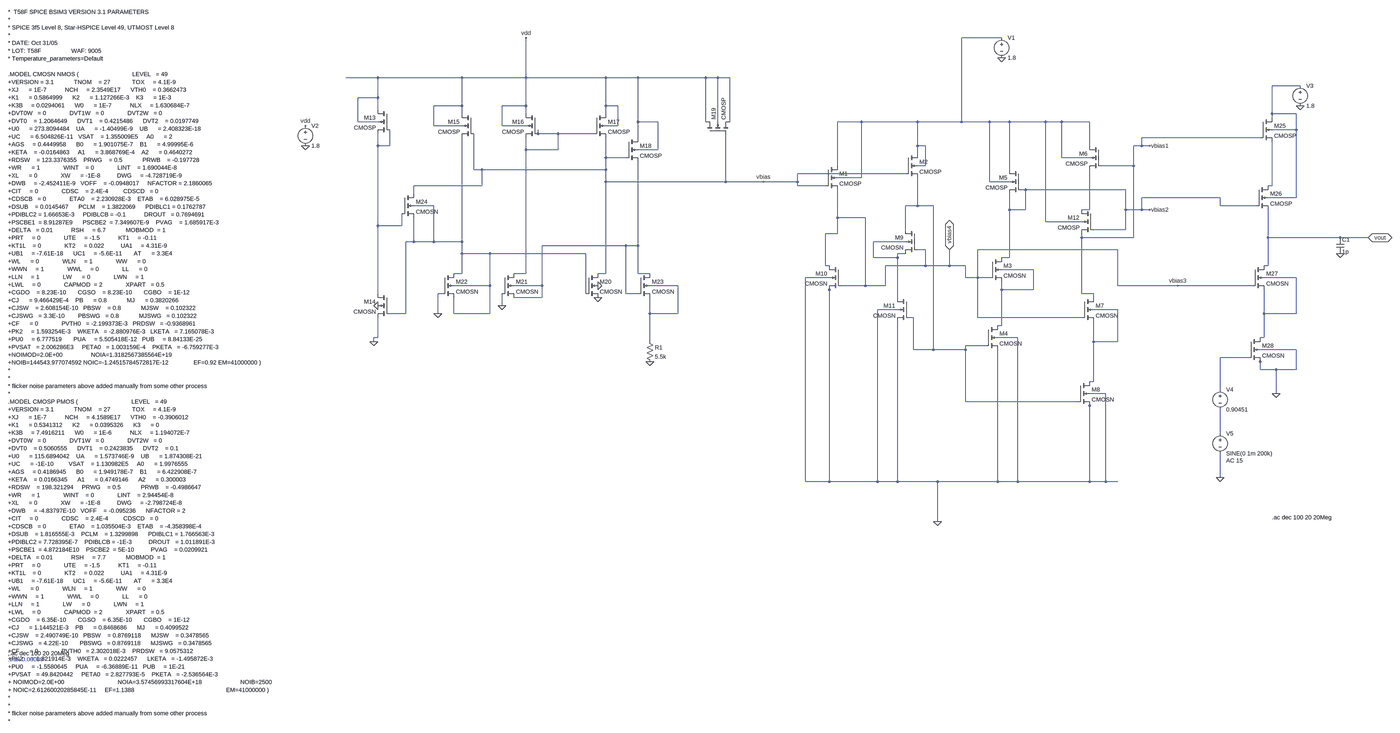
[diagram p0: schematic 180nm_circuit.asc, whole sheet]
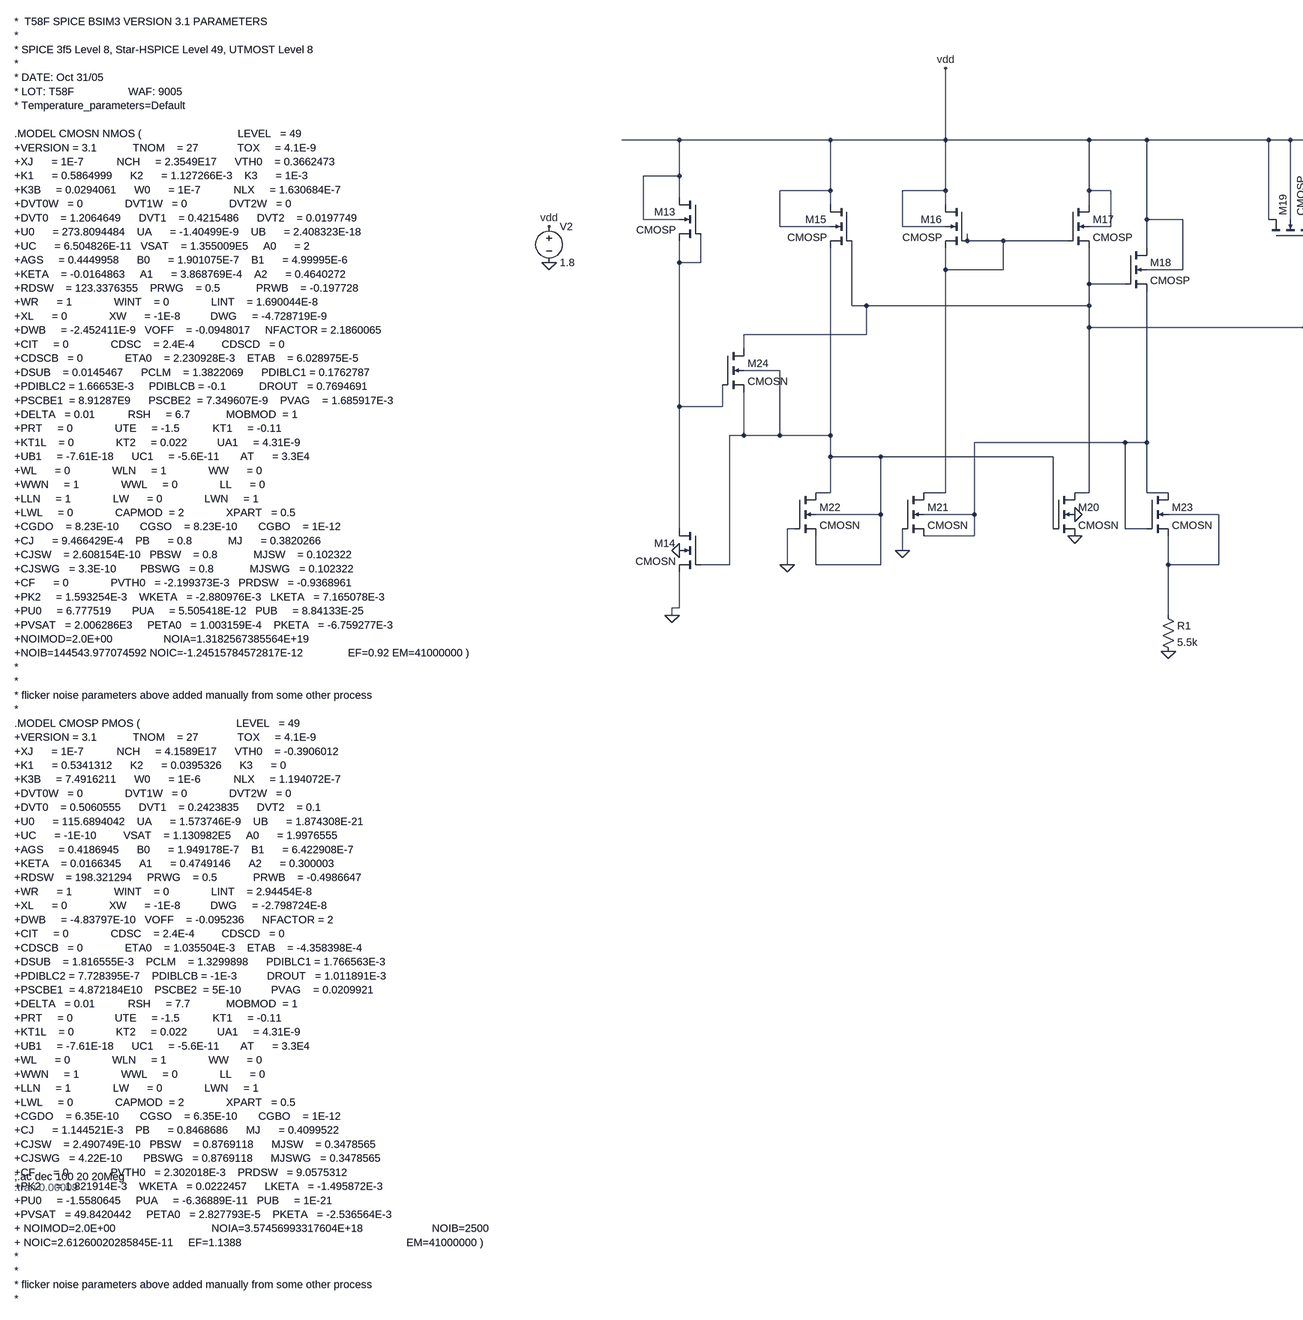
[diagram p1: schematic 180nm_circuit.asc, part, row 1 of 1, column 1 of 2]
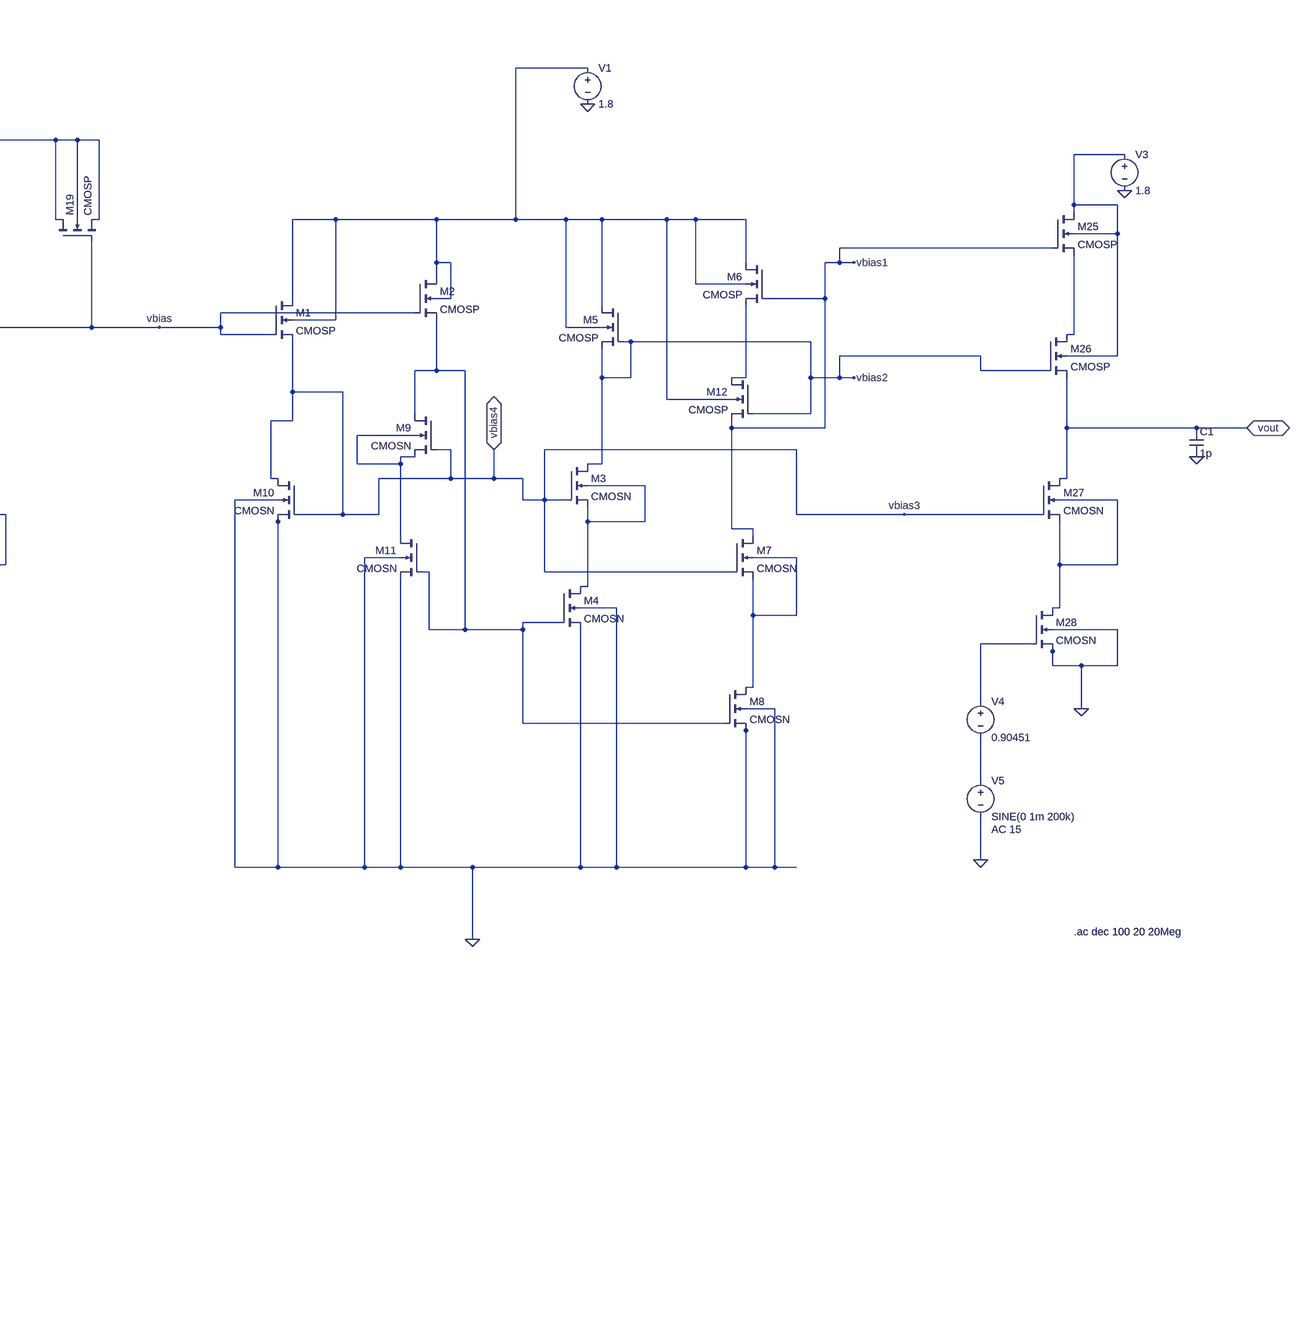
[diagram p2: schematic 180nm_circuit.asc, part, row 1 of 1, column 2 of 2]
180nm_circuit.asc, the LTspice schematic file:
Version 4
SHEET 1 3600 2120
WIRE 2016 -384 1856 -384
WIRE -960 -224 -1088 -224
WIRE -624 -224 -960 -224
WIRE -368 -224 -368 -384
WIRE -368 -224 -624 -224
WIRE -32 -224 -368 -224
WIRE 96 -224 -32 -224
WIRE 384 -224 96 -224
WIRE 432 -224 384 -224
WIRE 480 -224 432 -224
WIRE 3216 -192 3104 -192
WIRE -960 -144 -960 -224
WIRE -960 -144 -1040 -144
WIRE -624 -112 -624 -224
WIRE -624 -112 -736 -112
WIRE -368 -112 -368 -224
WIRE -368 -112 -464 -112
WIRE -32 -112 -32 -224
WIRE 16 -112 -32 -112
WIRE -960 -96 -960 -144
WIRE -624 -80 -624 -112
WIRE -368 -80 -368 -112
WIRE -32 -80 -32 -112
WIRE 3104 -80 3104 -192
WIRE 3200 -80 3104 -80
WIRE 3104 -64 3104 -80
WIRE -1040 -48 -1040 -144
WIRE -960 -48 -1040 -48
WIRE 96 -48 96 -224
WIRE 176 -48 96 -48
WIRE 384 -48 384 -224
WIRE 432 -48 432 -224
WIRE 480 -48 480 -224
WIRE 1456 -48 1360 -48
WIRE 1680 -48 1456 -48
WIRE 1856 -48 1856 -384
WIRE 1856 -48 1680 -48
WIRE 1968 -48 1856 -48
WIRE 2048 -48 1968 -48
WIRE 2192 -48 2048 -48
WIRE 2256 -48 2192 -48
WIRE 2368 -48 2256 -48
WIRE -736 -32 -736 -112
WIRE -624 -32 -736 -32
WIRE -464 -32 -464 -112
WIRE -368 -32 -464 -32
WIRE 16 -32 16 -112
WIRE 16 -32 -32 -32
WIRE 3200 -16 3200 -80
WIRE 3200 -16 3104 -16
WIRE -320 0 -320 -16
WIRE -240 0 -320 0
WIRE -80 0 -240 0
WIRE 96 16 96 -48
WIRE 3056 16 2576 16
WIRE -960 48 -960 0
WIRE -912 48 -912 -16
WIRE -912 48 -960 48
WIRE 1680 48 1680 -48
WIRE 1712 48 1680 48
WIRE 2368 48 2368 -48
WIRE 2576 48 2576 16
WIRE 2576 48 2544 48
WIRE 2608 48 2576 48
WIRE -368 64 -368 16
WIRE -240 64 -240 0
WIRE -240 64 -368 64
WIRE 176 64 176 -48
WIRE 176 64 96 64
WIRE 1680 80 1680 48
WIRE -32 96 -32 16
WIRE 48 96 -32 96
WIRE 2256 96 2256 -48
WIRE 2368 96 2256 96
WIRE 1360 128 1360 -48
WIRE 1712 128 1712 48
WIRE 1712 128 1680 128
WIRE 2544 128 2544 48
WIRE 2544 128 2416 128
WIRE -576 144 -576 0
WIRE -544 144 -576 144
WIRE -32 144 -32 96
WIRE -32 144 -544 144
WIRE 2048 144 2048 -48
WIRE 1632 160 1200 160
WIRE 1456 176 1456 -48
WIRE 1456 176 1360 176
WIRE -32 192 -32 144
WIRE 464 192 464 0
WIRE 464 192 -32 192
WIRE 816 192 464 192
WIRE 1200 192 1200 160
WIRE 1200 192 816 192
WIRE 1968 192 1968 -48
WIRE 2048 192 1968 192
WIRE -544 208 -544 144
WIRE -544 208 -816 208
WIRE 1200 208 1200 192
WIRE 1312 208 1200 208
WIRE 3104 208 3104 32
WIRE 3104 208 3088 208
WIRE 2112 224 2096 224
WIRE 2512 224 2112 224
WIRE -816 240 -816 208
WIRE 2896 256 2576 256
WIRE 3200 256 3200 -16
WIRE 3200 256 3088 256
WIRE -736 288 -816 288
WIRE 1680 288 1680 176
WIRE 1680 288 1632 288
WIRE 1744 288 1680 288
WIRE 2896 288 2896 256
WIRE 3040 288 2896 288
WIRE 2048 304 2048 240
WIRE 2112 304 2112 224
WIRE 2112 304 2048 304
WIRE 2368 304 2368 144
WIRE 2368 304 2336 304
WIRE 2512 304 2512 224
WIRE 2576 304 2576 256
WIRE 2576 304 2512 304
WIRE 2608 304 2576 304
WIRE 1360 336 1360 224
WIRE 1472 336 1360 336
WIRE 2192 352 2192 -48
WIRE 2336 352 2192 352
WIRE -960 368 -960 48
WIRE -864 368 -864 320
WIRE -864 368 -960 368
WIRE 1632 384 1632 288
WIRE 2512 384 2512 304
WIRE 2512 384 2384 384
WIRE 1360 400 1360 336
WIRE 1360 400 1312 400
WIRE 2336 416 2336 400
WIRE 2544 416 2544 128
WIRE 2544 416 2336 416
WIRE 3088 416 3088 304
WIRE 3376 416 3088 416
WIRE 3488 416 3376 416
WIRE -816 432 -816 336
WIRE -816 432 -848 432
WIRE -736 432 -736 288
WIRE -736 432 -816 432
WIRE -624 432 -624 16
WIRE -624 432 -736 432
WIRE 1632 432 1504 432
WIRE 48 448 -304 448
WIRE 96 448 96 112
WIRE 96 448 48 448
WIRE 1712 464 1680 464
WIRE 2480 464 1920 464
WIRE -624 480 -624 432
WIRE -512 480 -624 480
WIRE -112 480 -512 480
WIRE 1632 480 1600 480
WIRE 1504 496 1504 432
WIRE 1600 496 1600 480
WIRE 1600 496 1504 496
WIRE 2048 496 2048 304
WIRE 2048 496 2016 496
WIRE 1312 528 1312 400
WIRE 1328 528 1312 528
WIRE 1712 528 1712 464
WIRE 1712 528 1552 528
WIRE 1808 528 1808 464
WIRE 1808 528 1712 528
WIRE 1872 528 1808 528
WIRE 3088 528 3088 416
WIRE 3088 528 3072 528
WIRE 2144 544 2016 544
WIRE -624 560 -624 480
WIRE -624 560 -656 560
WIRE -368 560 -368 64
WIRE -368 560 -416 560
WIRE -32 560 -32 192
WIRE -32 560 -64 560
WIRE 96 560 96 448
WIRE 144 560 96 560
WIRE 1328 576 1232 576
WIRE 1872 576 1872 528
WIRE 1920 576 1920 464
WIRE 1920 576 1872 576
WIRE 1968 576 1920 576
WIRE 3200 576 3072 576
WIRE -512 608 -512 480
WIRE -512 608 -656 608
WIRE -304 608 -304 448
WIRE -304 608 -416 608
WIRE 256 608 144 608
WIRE 1472 608 1472 336
WIRE 1472 608 1376 608
WIRE 1552 608 1552 528
WIRE 1552 608 1472 608
WIRE 2480 608 2480 464
WIRE 2720 608 2480 608
WIRE 3024 608 2720 608
WIRE 1328 624 1328 608
WIRE 2016 624 2016 592
WIRE 2144 624 2144 544
WIRE 2144 624 2016 624
WIRE -960 640 -960 368
WIRE -704 640 -720 640
WIRE -112 640 -112 480
WIRE 48 640 48 448
WIRE 96 640 48 640
WIRE 2336 640 2336 416
WIRE 2384 640 2336 640
WIRE -304 656 -304 608
WIRE -304 656 -416 656
WIRE 1600 656 1600 496
WIRE 2384 656 2384 640
WIRE -464 688 -464 640
WIRE 1600 704 1520 704
WIRE 2480 704 2384 704
WIRE -848 720 -848 432
WIRE -848 720 -912 720
WIRE -720 720 -720 640
WIRE -656 720 -656 656
WIRE -512 720 -512 608
WIRE -512 720 -656 720
WIRE 144 720 144 656
WIRE 256 720 256 608
WIRE 256 720 144 720
WIRE 3072 720 3072 624
WIRE 3200 720 3200 576
WIRE 3200 720 3072 720
WIRE 1664 736 1648 736
WIRE 1920 736 1920 576
WIRE 2336 736 1920 736
WIRE 2016 768 2016 624
WIRE 2016 768 2000 768
WIRE -960 816 -960 736
WIRE -960 816 -976 816
WIRE 2080 816 2000 816
WIRE 3072 816 3072 720
WIRE 3072 816 3056 816
WIRE -976 832 -976 816
WIRE 144 832 144 720
WIRE 2384 832 2384 752
WIRE 2480 832 2480 704
WIRE 2480 832 2384 832
WIRE 1952 848 1872 848
WIRE 1664 864 1664 736
WIRE 1744 864 1744 288
WIRE 1744 864 1664 864
WIRE 1872 864 1872 848
WIRE 1872 864 1744 864
WIRE 3200 864 3056 864
WIRE 3008 896 2896 896
WIRE 3056 912 3056 896
WIRE 3056 944 3056 912
WIRE 3120 944 3056 944
WIRE 3200 944 3200 864
WIRE 3200 944 3120 944
WIRE 2384 992 2384 832
WIRE 2384 992 2368 992
WIRE 2896 1024 2896 896
WIRE 2432 1040 2368 1040
WIRE 3120 1040 3120 944
WIRE 1872 1072 1872 864
WIRE 2320 1072 1872 1072
WIRE 2368 1088 2368 1072
WIRE 2896 1200 2896 1104
WIRE 2896 1376 2896 1280
WIRE 1232 1392 1232 576
WIRE 1328 1392 1328 624
WIRE 1328 1392 1232 1392
WIRE 1520 1392 1520 704
WIRE 1520 1392 1328 1392
WIRE 1600 1392 1600 752
WIRE 1600 1392 1520 1392
WIRE 1760 1392 1600 1392
WIRE 2000 1392 2000 864
WIRE 2000 1392 1760 1392
WIRE 2080 1392 2080 816
WIRE 2080 1392 2000 1392
WIRE 2368 1392 2368 1088
WIRE 2368 1392 2080 1392
WIRE 2432 1392 2432 1040
WIRE 2432 1392 2368 1392
WIRE 2480 1392 2432 1392
WIRE 1760 1552 1760 1392
FLAG 1808 464 vbias4
IOPIN 1808 464 BiDir
FLAG 2608 304 vbias2
FLAG 2608 48 vbias1
FLAG 2016 -304 0
FLAG 1760 1552 0
FLAG 144 912 0
FLAG -64 656 0
FLAG -464 688 0
FLAG -720 720 0
FLAG -976 832 0
FLAG -64 608 0
FLAG -960 688 0
FLAG -1456 48 0
FLAG -1456 -32 vdd
FLAG -368 -384 vdd
FLAG 816 192 vbias
FLAG 3216 -112 0
FLAG 3120 1040 0
FLAG 2896 1376 0
FLAG 3376 480 0
FLAG 3488 416 vout
IOPIN 3488 416 BiDir
FLAG 2720 608 vbias3
DATAFLAG 2048 352 ""
DATAFLAG 2048 96 ""
SYMBOL nmos4 1312 128 R0
SYMATTR InstName M1
SYMATTR Value CMOSP
SYMATTR Value2 l=2u w=24u
SYMBOL nmos4 1632 80 R0
SYMATTR InstName M2
SYMATTR Value CMOSP
SYMATTR Value2 l=2u w=24u
SYMBOL nmos4 1968 496 R0
SYMATTR InstName M3
SYMATTR Value CMOSN
SYMATTR Value2 l=2u w=10u
SYMBOL nmos4 1952 768 R0
SYMATTR InstName M4
SYMATTR Value CMOSN
SYMATTR Value2 l=2u w=10u
SYMBOL nmos4 2096 144 M0
SYMATTR InstName M5
SYMATTR Value CMOSP
SYMATTR Value2 l=2u w=24u
SYMBOL nmos4 2416 48 M0
SYMATTR InstName M6
SYMATTR Value CMOSP
SYMATTR Value2 l=2u w=24u
SYMBOL nmos4 2336 656 R0
SYMATTR InstName M7
SYMATTR Value CMOSN
SYMATTR Value2 l=2u w=10u
SYMBOL nmos4 2320 992 R0
SYMATTR InstName M8
SYMATTR Value CMOSN
SYMATTR Value2 l=2u w=10u
SYMBOL nmos4 1680 384 M0
SYMATTR InstName M9
SYMATTR Value CMOSN
SYMATTR Value2 l=2u w=10u
SYMBOL nmos4 1376 528 M0
SYMATTR InstName M10
SYMATTR Value CMOSN
SYMATTR Value2 l=2u w=10u
SYMBOL nmos4 1648 656 M0
SYMATTR InstName M11
SYMATTR Value CMOSN
SYMATTR Value2 l=2u w=10u
SYMBOL nmos4 2384 304 M0
SYMATTR InstName M12
SYMATTR Value CMOSP
SYMATTR Value2 l=2u w=24u
SYMBOL voltage 2016 -400 R0
WINDOW 123 0 0 Left 0
WINDOW 39 0 0 Left 0
SYMATTR InstName V1
SYMATTR Value 1.8
SYMBOL nmos4 -912 -96 M0
SYMATTR InstName M13
SYMATTR Value CMOSP
SYMATTR Value2 l=2u w=24u
SYMBOL nmos4 -912 640 M0
SYMATTR InstName M14
SYMATTR Value CMOSN
SYMATTR Value2 l=2u w=10u
SYMBOL nmos4 -576 -80 M0
SYMATTR InstName M15
SYMATTR Value CMOSP
SYMATTR Value2 l=2u w=24u
SYMBOL nmos4 -320 -80 M0
SYMATTR InstName M16
SYMATTR Value CMOSP
SYMATTR Value2 l=2u w=24u
SYMBOL nmos4 -80 -80 R0
SYMATTR InstName M17
SYMATTR Value CMOSP
SYMATTR Value2 l=2u w=24u
SYMBOL nmos4 48 16 R0
SYMATTR InstName M18
SYMATTR Value CMOSP
SYMATTR Value2 l=2u w=24u
SYMBOL nmos4 384 0 R270
SYMATTR InstName M19
SYMATTR Value CMOSP
SYMATTR Value2 l=2u w=24u
SYMBOL nmos4 -112 560 R0
SYMATTR InstName M20
SYMATTR Value CMOSN
SYMATTR Value2 l=2u w=10u
SYMBOL nmos4 -464 560 R0
SYMATTR InstName M21
SYMATTR Value CMOSN
SYMATTR Value2 l=2u w=10u
SYMBOL nmos4 -704 560 R0
SYMATTR InstName M22
SYMATTR Value CMOSN
SYMATTR Value2 l=2u w=10u
SYMBOL nmos4 96 560 R0
SYMATTR InstName M23
SYMATTR Value CMOSN
SYMATTR Value2 l=2u w=10u
SYMBOL nmos4 -864 240 R0
SYMATTR InstName M24
SYMATTR Value CMOSN
SYMATTR Value2 l=2u w=10u
SYMBOL res 128 816 R0
SYMATTR InstName R1
SYMATTR Value 5.5k
SYMBOL voltage -1456 -48 R0
WINDOW 123 0 0 Left 0
WINDOW 39 0 0 Left 0
SYMATTR InstName V2
SYMATTR Value 1.8
SYMBOL nmos4 3056 -64 R0
SYMATTR InstName M25
SYMATTR Value CMOSP
SYMATTR Value2 l=0.18u w=1.713u
SYMBOL nmos4 3040 208 R0
SYMATTR InstName M26
SYMATTR Value CMOSP
SYMATTR Value2 l=0.18u w=1.713u
SYMBOL nmos4 3024 528 R0
SYMATTR InstName M27
SYMATTR Value CMOSN
SYMATTR Value2 l=0.18u w=0.579u
SYMBOL nmos4 3008 816 R0
SYMATTR InstName M28
SYMATTR Value CMOSN
SYMATTR Value2 l=0.18u w=0.579u
SYMBOL voltage 3216 -208 R0
WINDOW 123 0 0 Left 0
WINDOW 39 0 0 Left 0
SYMATTR InstName V3
SYMATTR Value 1.8
SYMBOL cap 3360 416 R0
SYMATTR InstName C1
SYMATTR Value 1p
SYMBOL voltage 2896 1008 R0
WINDOW 123 0 0 Left 0
WINDOW 39 0 0 Left 0
SYMATTR InstName V4
SYMATTR Value 0.90451
SYMBOL voltage 2896 1184 R0
WINDOW 123 24 124 Left 2
WINDOW 39 0 0 Left 0
SYMATTR Value2 AC 15
SYMATTR InstName V5
SYMATTR Value SINE(0 1m 200k)
TEXT -2928 -488 Left 2 !*  T58F SPICE BSIM3 VERSION 3.1 PARAMETERS\n* \n* SPICE 3f5 Level 8, Star-HSPICE Level 49, UTMOST Level 8\n* \n* DATE: Oct 31/05\n* LOT: T58F                  WAF: 9005\n* Temperature_parameters=Default\n \n.MODEL CMOSN NMOS (                                LEVEL   = 49\n+VERSION = 3.1            TNOM    = 27             TOX     = 4.1E-9\n+XJ      = 1E-7           NCH     = 2.3549E17      VTH0    = 0.3662473\n+K1      = 0.5864999      K2      = 1.127266E-3    K3      = 1E-3\n+K3B     = 0.0294061      W0      = 1E-7           NLX     = 1.630684E-7\n+DVT0W   = 0              DVT1W   = 0              DVT2W   = 0\n+DVT0    = 1.2064649      DVT1    = 0.4215486      DVT2    = 0.0197749\n+U0      = 273.8094484    UA      = -1.40499E-9    UB      = 2.408323E-18\n+UC      = 6.504826E-11   VSAT    = 1.355009E5     A0      = 2\n+AGS     = 0.4449958      B0      = 1.901075E-7    B1      = 4.99995E-6\n+KETA    = -0.0164863     A1      = 3.868769E-4    A2      = 0.4640272\n+RDSW    = 123.3376355    PRWG    = 0.5            PRWB    = -0.197728\n+WR      = 1              WINT    = 0              LINT    = 1.690044E-8\n+XL      = 0              XW      = -1E-8          DWG     = -4.728719E-9\n+DWB     = -2.452411E-9   VOFF    = -0.0948017     NFACTOR = 2.1860065\n+CIT     = 0              CDSC    = 2.4E-4         CDSCD   = 0\n+CDSCB   = 0              ETA0    = 2.230928E-3    ETAB    = 6.028975E-5\n+DSUB    = 0.0145467      PCLM    = 1.3822069      PDIBLC1 = 0.1762787\n+PDIBLC2 = 1.66653E-3     PDIBLCB = -0.1           DROUT   = 0.7694691\n+PSCBE1  = 8.91287E9      PSCBE2  = 7.349607E-9    PVAG    = 1.685917E-3\n+DELTA   = 0.01           RSH     = 6.7            MOBMOD  = 1\n+PRT     = 0              UTE     = -1.5           KT1     = -0.11\n+KT1L    = 0              KT2     = 0.022          UA1     = 4.31E-9\n+UB1     = -7.61E-18      UC1     = -5.6E-11       AT      = 3.3E4\n+WL      = 0              WLN     = 1              WW      = 0\n+WWN     = 1              WWL     = 0              LL      = 0\n+LLN     = 1              LW      = 0              LWN     = 1\n+LWL     = 0              CAPMOD  = 2              XPART   = 0.5\n+CGDO    = 8.23E-10       CGSO    = 8.23E-10       CGBO    = 1E-12\n+CJ      = 9.466429E-4    PB      = 0.8            MJ      = 0.3820266\n+CJSW    = 2.608154E-10   PBSW    = 0.8            MJSW    = 0.102322\n+CJSWG   = 3.3E-10        PBSWG   = 0.8            MJSWG   = 0.102322\n+CF      = 0              PVTH0   = -2.199373E-3   PRDSW   = -0.9368961\n+PK2     = 1.593254E-3    WKETA   = -2.880976E-3   LKETA   = 7.165078E-3\n+PU0     = 6.777519       PUA     = 5.505418E-12   PUB     = 8.84133E-25\n+PVSAT   = 2.006286E3     PETA0   = 1.003159E-4    PKETA   = -6.759277E-3\n+NOIMOD=2.0E+00                 NOIA=1.3182567385564E+19\n+NOIB=144543.977074592 NOIC=-1.24515784572817E-12               EF=0.92 EM=41000000 )\n*\n*\n* flicker noise parameters above added manually from some other process\n* \n.MODEL CMOSP PMOS (                                LEVEL   = 49\n+VERSION = 3.1            TNOM    = 27             TOX     = 4.1E-9\n+XJ      = 1E-7           NCH     = 4.1589E17      VTH0    = -0.3906012\n+K1      = 0.5341312      K2      = 0.0395326      K3      = 0\n+K3B     = 7.4916211      W0      = 1E-6           NLX     = 1.194072E-7\n+DVT0W   = 0              DVT1W   = 0              DVT2W   = 0\n+DVT0    = 0.5060555      DVT1    = 0.2423835      DVT2    = 0.1\n+U0      = 115.6894042    UA      = 1.573746E-9    UB      = 1.874308E-21\n+UC      = -1E-10         VSAT    = 1.130982E5     A0      = 1.9976555\n+AGS     = 0.4186945      B0      = 1.949178E-7    B1      = 6.422908E-7\n+KETA    = 0.0166345      A1      = 0.4749146      A2      = 0.300003\n+RDSW    = 198.321294     PRWG    = 0.5            PRWB    = -0.4986647\n+WR      = 1              WINT    = 0              LINT    = 2.94454E-8\n+XL      = 0              XW      = -1E-8          DWG     = -2.798724E-8\n+DWB     = -4.83797E-10   VOFF    = -0.095236      NFACTOR = 2\n+CIT     = 0              CDSC    = 2.4E-4         CDSCD   = 0\n+CDSCB   = 0              ETA0    = 1.035504E-3    ETAB    = -4.358398E-4\n+DSUB    = 1.816555E-3    PCLM    = 1.3299898      PDIBLC1 = 1.766563E-3\n+PDIBLC2 = 7.728395E-7    PDIBLCB = -1E-3          DROUT   = 1.011891E-3\n+PSCBE1  = 4.872184E10    PSCBE2  = 5E-10          PVAG    = 0.0209921\n+DELTA   = 0.01           RSH     = 7.7            MOBMOD  = 1\n+PRT     = 0              UTE     = -1.5           KT1     = -0.11\n+KT1L    = 0              KT2     = 0.022          UA1     = 4.31E-9\n+UB1     = -7.61E-18      UC1     = -5.6E-11       AT      = 3.3E4\n+WL      = 0              WLN     = 1              WW      = 0\n+WWN     = 1              WWL     = 0              LL      = 0\n+LLN     = 1              LW      = 0              LWN     = 1\n+LWL     = 0              CAPMOD  = 2              XPART   = 0.5\n+CGDO    = 6.35E-10       CGSO    = 6.35E-10       CGBO    = 1E-12\n+CJ      = 1.144521E-3    PB      = 0.8468686      MJ      = 0.4099522\n+CJSW    = 2.490749E-10   PBSW    = 0.8769118      MJSW    = 0.3478565\n+CJSWG   = 4.22E-10       PBSWG   = 0.8769118      MJSWG   = 0.3478565\n+CF      = 0              PVTH0   = 2.302018E-3    PRDSW   = 9.0575312\n+PK2     = 1.821914E-3    WKETA   = 0.0222457      LKETA   = -1.495872E-3\n+PU0     = -1.5580645     PUA     = -6.36889E-11   PUB     = 1E-21\n+PVSAT   = 49.8420442     PETA0   = 2.827793E-5    PKETA   = -2.536564E-3 \n+ NOIMOD=2.0E+00                                NOIA=3.57456993317604E+18                       NOIB=2500\n+ NOIC=2.61260020285845E-11     EF=1.1388                                                       EM=41000000 )\n*\n*\n* flicker noise parameters above added manually from some other process\n*
TEXT -2928 2080 Left 2 !;.ac dec 100 20 20Meg
TEXT 3104 1536 Left 2 !.ac dec 100 20 20Meg
TEXT -2928 2104 Left 2 ;.tran 0.00009

The netlist it stands for:
* 180nm_circuit.asc
M1 N001 vbias vbias3 N001 CMOSP l=2u w=24u
M2 N001 vbias N007 N001 CMOSP l=2u w=24u
M3 vbias2 vbias3 N011 N011 CMOSN l=2u w=10u
M4 N011 N007 0 0 CMOSN l=2u w=10u
M5 N001 vbias2 vbias2 N001 CMOSP l=2u w=24u
M6 N001 vbias1 N008 N001 CMOSP l=2u w=24u
M7 vbias1 vbias3 N014 N014 CMOSN l=2u w=10u
M8 N014 N007 0 0 CMOSN l=2u w=10u
M9 N007 vbias3 N009 N009 CMOSN l=2u w=10u
M10 vbias3 vbias3 0 0 CMOSN l=2u w=10u
M11 N009 N007 0 0 CMOSN l=2u w=10u
M12 N008 vbias2 vbias1 N001 CMOSP l=2u w=24u
V1 N001 0 1.8
M13 vdd N004 N004 vdd CMOSP l=2u w=24u
M14 N004 N006 0 0 CMOSN l=2u w=10u
M15 vdd vbias N006 vdd CMOSP l=2u w=24u
M16 vdd N003 N003 vdd CMOSP l=2u w=24u
M17 vdd N003 vbias vdd CMOSP l=2u w=24u
M18 vdd vbias N010 vdd CMOSP l=2u w=24u
M19 vdd vbias vdd vdd CMOSP l=2u w=24u
M20 vbias N006 0 0 CMOSN l=2u w=10u
M21 N003 0 N010 N010 CMOSN l=2u w=10u
M22 N006 0 N006 N006 CMOSN l=2u w=10u
M23 N010 N010 N013 N013 CMOSN l=2u w=10u
M24 vbias N004 N006 N006 CMOSN l=2u w=10u
R1 N013 0 5.5k
V2 vdd 0 1.8
M25 N002 vbias1 N005 N002 CMOSP l=0.18u w=1.713u
M26 N005 vbias2 vout N002 CMOSP l=0.18u w=1.713u
M27 vout vbias3 N012 N012 CMOSN l=0.18u w=0.579u
M28 N012 N015 0 0 CMOSN l=0.18u w=0.579u
V3 N002 0 1.8
C1 vout 0 1p
V4 N015 N016 0.90451
V5 N016 0 SINE(0 1m 200k) AC 15
.model NMOS NMOS
.model PMOS PMOS
.lib standard.mos
*  T58F SPICE BSIM3 VERSION 3.1 PARAMETERS
*
* SPICE 3f5 Level 8, Star-HSPICE Level 49, UTMOST Level 8
*
* DATE: Oct 31/05
* LOT: T58F                  WAF: 9005
* Temperature_parameters=Default
.MODEL CMOSN NMOS (                                LEVEL   = 49
+VERSION = 3.1            TNOM    = 27             TOX     = 4.1E-9
+XJ      = 1E-7           NCH     = 2.3549E17      VTH0    = 0.3662473
+K1      = 0.5864999      K2      = 1.127266E-3    K3      = 1E-3
+K3B     = 0.0294061      W0      = 1E-7           NLX     = 1.630684E-7
+DVT0W   = 0              DVT1W   = 0              DVT2W   = 0
+DVT0    = 1.2064649      DVT1    = 0.4215486      DVT2    = 0.0197749
+U0      = 273.8094484    UA      = -1.40499E-9    UB      = 2.408323E-18
+UC      = 6.504826E-11   VSAT    = 1.355009E5     A0      = 2
+AGS     = 0.4449958      B0      = 1.901075E-7    B1      = 4.99995E-6
+KETA    = -0.0164863     A1      = 3.868769E-4    A2      = 0.4640272
+RDSW    = 123.3376355    PRWG    = 0.5            PRWB    = -0.197728
+WR      = 1              WINT    = 0              LINT    = 1.690044E-8
+XL      = 0              XW      = -1E-8          DWG     = -4.728719E-9
+DWB     = -2.452411E-9   VOFF    = -0.0948017     NFACTOR = 2.1860065
+CIT     = 0              CDSC    = 2.4E-4         CDSCD   = 0
+CDSCB   = 0              ETA0    = 2.230928E-3    ETAB    = 6.028975E-5
+DSUB    = 0.0145467      PCLM    = 1.3822069      PDIBLC1 = 0.1762787
+PDIBLC2 = 1.66653E-3     PDIBLCB = -0.1           DROUT   = 0.7694691
+PSCBE1  = 8.91287E9      PSCBE2  = 7.349607E-9    PVAG    = 1.685917E-3
+DELTA   = 0.01           RSH     = 6.7            MOBMOD  = 1
+PRT     = 0              UTE     = -1.5           KT1     = -0.11
+KT1L    = 0              KT2     = 0.022          UA1     = 4.31E-9
+UB1     = -7.61E-18      UC1     = -5.6E-11       AT      = 3.3E4
+WL      = 0              WLN     = 1              WW      = 0
+WWN     = 1              WWL     = 0              LL      = 0
+LLN     = 1              LW      = 0              LWN     = 1
+LWL     = 0              CAPMOD  = 2              XPART   = 0.5
+CGDO    = 8.23E-10       CGSO    = 8.23E-10       CGBO    = 1E-12
+CJ      = 9.466429E-4    PB      = 0.8            MJ      = 0.3820266
+CJSW    = 2.608154E-10   PBSW    = 0.8            MJSW    = 0.102322
+CJSWG   = 3.3E-10        PBSWG   = 0.8            MJSWG   = 0.102322
+CF      = 0              PVTH0   = -2.199373E-3   PRDSW   = -0.9368961
+PK2     = 1.593254E-3    WKETA   = -2.880976E-3   LKETA   = 7.165078E-3
+PU0     = 6.777519       PUA     = 5.505418E-12   PUB     = 8.84133E-25
+PVSAT   = 2.006286E3     PETA0   = 1.003159E-4    PKETA   = -6.759277E-3
+NOIMOD=2.0E+00                 NOIA=1.3182567385564E+19
+NOIB=144543.977074592 NOIC=-1.24515784572817E-12               EF=0.92 EM=41000000 )
*
*
* flicker noise parameters above added manually from some other process
*
.MODEL CMOSP PMOS (                                LEVEL   = 49
+VERSION = 3.1            TNOM    = 27             TOX     = 4.1E-9
+XJ      = 1E-7           NCH     = 4.1589E17      VTH0    = -0.3906012
+K1      = 0.5341312      K2      = 0.0395326      K3      = 0
+K3B     = 7.4916211      W0      = 1E-6           NLX     = 1.194072E-7
+DVT0W   = 0              DVT1W   = 0              DVT2W   = 0
+DVT0    = 0.5060555      DVT1    = 0.2423835      DVT2    = 0.1
+U0      = 115.6894042    UA      = 1.573746E-9    UB      = 1.874308E-21
+UC      = -1E-10         VSAT    = 1.130982E5     A0      = 1.9976555
+AGS     = 0.4186945      B0      = 1.949178E-7    B1      = 6.422908E-7
+KETA    = 0.0166345      A1      = 0.4749146      A2      = 0.300003
+RDSW    = 198.321294     PRWG    = 0.5            PRWB    = -0.4986647
+WR      = 1              WINT    = 0              LINT    = 2.94454E-8
+XL      = 0              XW      = -1E-8          DWG     = -2.798724E-8
+DWB     = -4.83797E-10   VOFF    = -0.095236      NFACTOR = 2
+CIT     = 0              CDSC    = 2.4E-4         CDSCD   = 0
+CDSCB   = 0              ETA0    = 1.035504E-3    ETAB    = -4.358398E-4
+DSUB    = 1.816555E-3    PCLM    = 1.3299898      PDIBLC1 = 1.766563E-3
+PDIBLC2 = 7.728395E-7    PDIBLCB = -1E-3          DROUT   = 1.011891E-3
+PSCBE1  = 4.872184E10    PSCBE2  = 5E-10          PVAG    = 0.0209921
+DELTA   = 0.01           RSH     = 7.7            MOBMOD  = 1
+PRT     = 0              UTE     = -1.5           KT1     = -0.11
+KT1L    = 0              KT2     = 0.022          UA1     = 4.31E-9
+UB1     = -7.61E-18      UC1     = -5.6E-11       AT      = 3.3E4
+WL      = 0              WLN     = 1              WW      = 0
+WWN     = 1              WWL     = 0              LL      = 0
+LLN     = 1              LW      = 0              LWN     = 1
+LWL     = 0              CAPMOD  = 2              XPART   = 0.5
+CGDO    = 6.35E-10       CGSO    = 6.35E-10       CGBO    = 1E-12
+CJ      = 1.144521E-3    PB      = 0.8468686      MJ      = 0.4099522
+CJSW    = 2.490749E-10   PBSW    = 0.8769118      MJSW    = 0.3478565
+CJSWG   = 4.22E-10       PBSWG   = 0.8769118      MJSWG   = 0.3478565
+CF      = 0              PVTH0   = 2.302018E-3    PRDSW   = 9.0575312
+PK2     = 1.821914E-3    WKETA   = 0.0222457      LKETA   = -1.495872E-3
+PU0     = -1.5580645     PUA     = -6.36889E-11   PUB     = 1E-21
+PVSAT   = 49.8420442     PETA0   = 2.827793E-5    PKETA   = -2.536564E-3
+ NOIMOD=2.0E+00                                NOIA=3.57456993317604E+18                       NOIB=2500
+ NOIC=2.61260020285845E-11     EF=1.1388                                                       EM=41000000 )
*
*
* flicker noise parameters above added manually from some other process
*
;.ac dec 100 20 20Meg
.ac dec 100 20 20Meg
* .tran 0.00009
.backanno
.end